# Altium schematic sheet MCP2515_PINOUT.SchDoc
size A; SheetNumber: 6; SheetTotal: 17
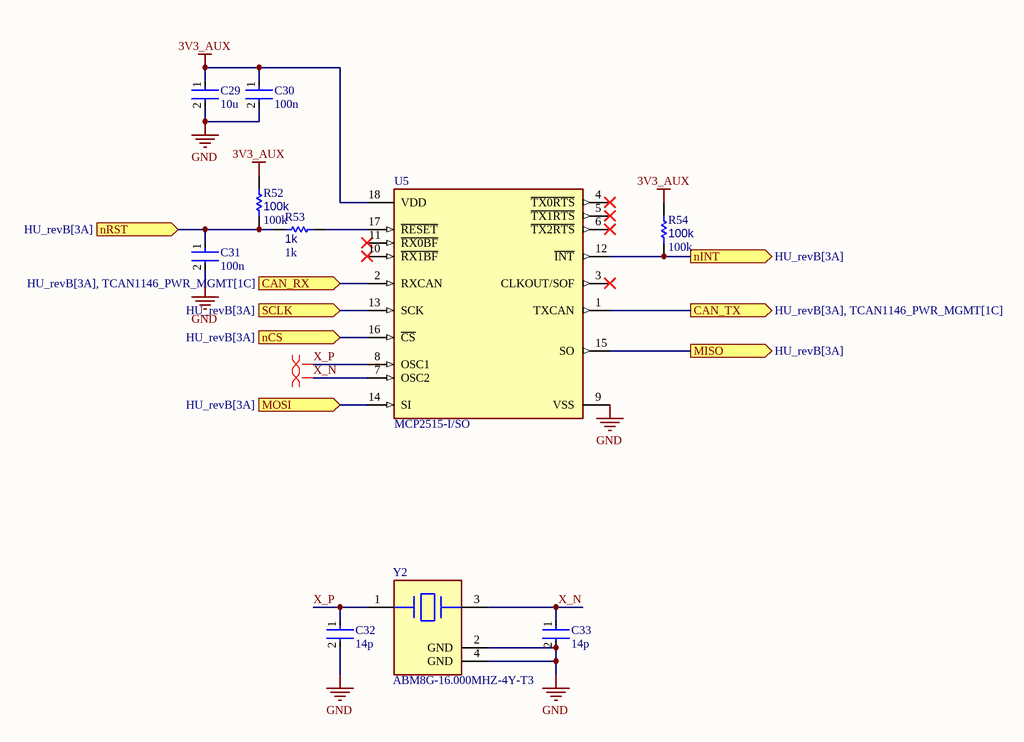
[diagram p0: MCP2515_PINOUT.SchDoc]

## Parts
C29  10u  [FP-0402-L_1_0_0_05-W_0_5-IPC_A]
C30  100n  [FP-0402-L_1_0_0_05-W_0_5-IPC_A]
C31  100n  [FP-0402-L_1_0_0_05-W_0_5-IPC_A]
C32  14p  [FP-0402-L_1_0_0_05-W_0_5-IPC_A]
C33  14p  [FP-0402-L_1_0_0_05-W_0_5-IPC_A]
R52  100k  [R0603B]
R53  1k  [R0603B]
R54  100k  [R0603B]
U5  MCP2515-I/SO  [FP-C04-051-MFG]
Y2  ABM8G-16.000MHZ-4Y-T3  [FP-ABM8G-MFG]

## Ports
CAN_RX (in, see HU_revB[3A], TCAN1146_PWR_MGMT[1C]), CAN_TX (out, see HU_revB[3A], TCAN1146_PWR_MGMT[1C]), MISO (out, see HU_revB[3A]), MOSI (in, see HU_revB[3A]), nCS (in, see HU_revB[3A]), nINT (out, see HU_revB[3A]), nRST (in, see HU_revB[3A]), SCLK (in, see HU_revB[3A])

## Nets
3V3_AUX: C29.1 C30.1 R52.1 R54.1 U5.18(VDD)
GND: C29.2 C30.2 C31.2 C32.2 C33.2 U5.9(VSS) Y2.2(GND) Y2.4(GND)
CAN_RX: U5.2(RXCAN) ; port CAN_RX
CAN_TX: U5.1(TXCAN) ; port CAN_TX
MISO: U5.15(SO) ; port MISO
MOSI: U5.14(SI) ; port MOSI
nCS: U5.16(~{CS}) ; port nCS
nINT: R54.2 U5.12(~{INT}) ; port nINT
nRST: C31.1 R52.2 R53.2 ; port nRST
SCLK: U5.13(SCK) ; port SCLK
X_N: C33.1 U5.7(OSC2) Y2.3
X_P: C32.1 U5.8(OSC1) Y2.1
NetR53_1: R53.1 U5.17(~{RESET})

Not connected (* = marked no-connect by the designer): U5 3(CLKOUT/SOF)* 4(~{TX0RTS})* 5(~{TX1RTS})* 6(~{TX2RTS})* 10(~{RX1BF})* 11(~{RX0BF})*

## Layout directives
differential pair: X_N, X_P

## Library data of the parts
C29-C33 = CMP-001-00058-1: LARGE PADS, 0402 CAP, CHANGE COMMENT TO MATCH REAL P/N; Capacitor Type: Ceramic; Min Operating Temperature: -55°C; Mounting Technology: Surface Mount; Pins: 2; Case/Package: 0402; RoHS Compliant: Yes; Max Operating Temperature: 85°C
R52-R54 = CMP-009-00002-14: Resistor
  R52 R54: Value: 100k
  R53: Value: 1k
U5 = CMP-0186-00133-3: IC CAN CONTROLLER W/SPI 18SOIC; Manufacturer: Microchip; Min Supply Voltage: 2.7V; Max Supply Voltage: 5.5V; Standoff Height: 0.1mm; Nominal Supply Current: 10mA; Interface: SPI,CAN; Lead Free: Yes; Digikey Description: IC CAN CONTROLLER W/SPI 18SOIC; Category: IC; RoHS: TRUE; Manufacturer Part Number: MCP2515-I/SO; ComponentLink2URL: http://ww1.microchip.com/downloads/en/DeviceDoc/MCP2515-Stand-Alone-CAN-Controller-with-SPI-20001801J.pdf; Mouser Description: CAN Interface IC W/ SPI Interface; Device Class L2: Interface ICs; Package: C04-051; Automotive: No; Function: Controller; Octopart: https://octopart.com/mcp2515-i%2Fso-microchip-430187; Temperature: -40°C to +85°C; Ipc Land Pattern Name: SOIC127P1030X265-18; Ambient Temperature Range Low: -65°C; Height: 2.65mm; Device Class L1: Integrated Circuits (ICs); Ambient Temperature Range High: +125°C; Footprint Url: http://ww1.microchip.com/downloads/en/DeviceDoc/18L_SOIC_Wide_7.50_SO_C04-0051D.pdf; Temperature Range Low: -40°C; Device Class L3: Controllers; Temperature Range High: +85°C; ComponentLink2Description: Datasheet
Y2 = CMP-27762-015134-1: Crystal 16MHz ±30ppm (Tol) ±30ppm (Stability) 10pF FUND 80Ω 4-Pin SMD T/R; Series Resistance: 80R; Mount: Surface Mount; Width: 0.098inch; Load Capacitance: 10pF; Length: 3.2mm; Series: ABM8G; Max Operating Temperature: 60°C; Depth: 2.5mm; Frequency: 16MHz; Frequency Tolerance: 30ppm; Height: 0.039inch; ESR (Equivalent Series Resistance): 80R; Case/Package: SMD/SMT; Lead Free: Lead Free; Frequency Stability: 30ppm; Packaging: Tape and Reel; Number of Pins: 4; REACH SVHC: No SVHC; Min Operating Temperature: -10°C